# Altium schematic sheet RFID reader circuit.SchDoc
size Letter
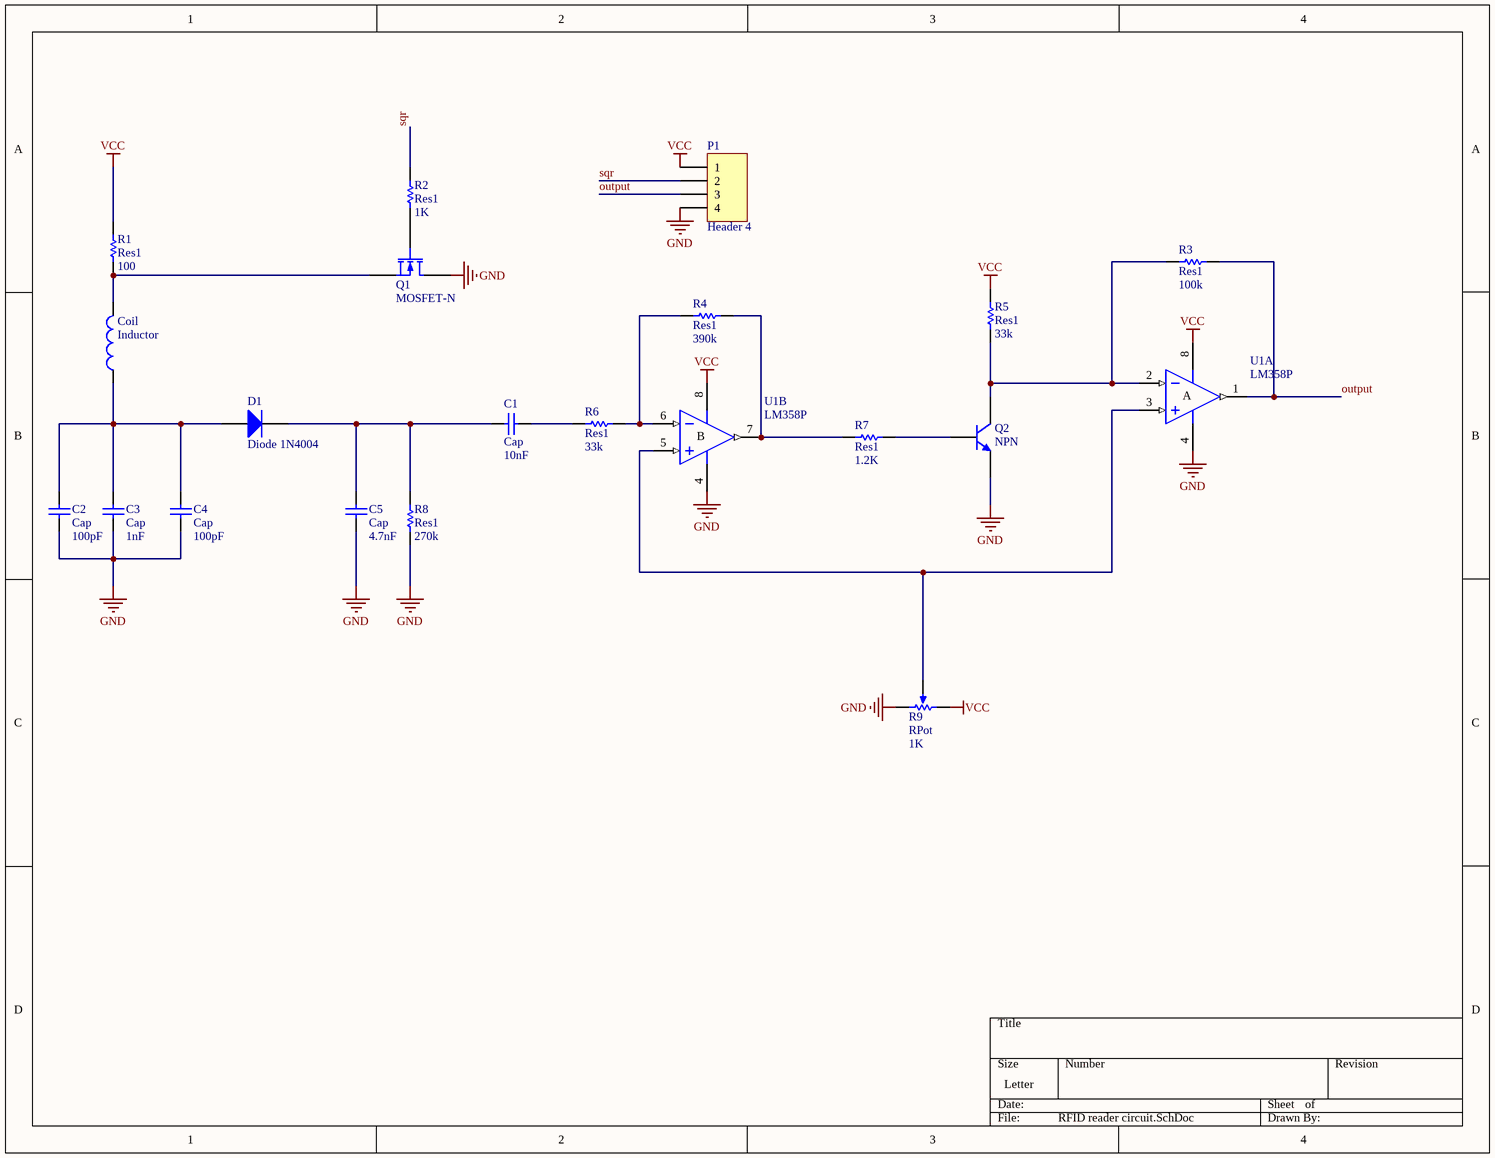
[diagram p0: RFID reader circuit.SchDoc]

## Parts
C1  Cap  value 10nF  [RAD-0.3]
C2  Cap  value 100pF  [RAD-0.3]
C3  Cap  value 1nF  [RAD-0.3]
C4  Cap  value 100pF  [RAD-0.3]
C5  Cap  value 4.7nF  [RAD-0.3]
Coil  Inductor  [XTAL-2]
D1  Diode 1N4004  [DO-41]
P1  Header 4  [HDR1X4]
Q1  MOSFET-N  [E3]
Q2  NPN  [TO-226-AA]
R1  Res1  value 100  [AXIAL-0.3]
R2  Res1  value 1K  [AXIAL-0.3]
R3  Res1  value 100k  [AXIAL-0.3]
R4  Res1  value 390k  [AXIAL-0.3]
R5  Res1  value 33k  [AXIAL-0.3]
R6  Res1  value 33k  [AXIAL-0.3]
R7  Res1  value 1.2K  [AXIAL-0.3]
R8  Res1  value 270k  [AXIAL-0.3]
R9  RPot  value 1K  [VR5]
U1  LM358P  [P008]  (parts A,B of 2)

## Nets
GND: C2.1 C3.1 C4.1 C5.1 P1.4 Q1.1(D) Q2.3(E) R8.2 R9.2(BOT) U1.4(V-)
VCC: P1.1 R1.2 R5.2 R9.1(TOP) U1.8(V+)
output: P1.3 R3.1 U1.1(OUT)
sqr: P1.2 R2.2
NetC1_1: C1.1 R6.1
NetC1_2: C1.2 C5.2 D1.2(K) R8.1
NetC2_2: C2.2 C3.2 C4.2 Coil.1 D1.1(A)
NetCoil_2: Coil.2 Q1.3(S) R1.1
NetQ1_2: Q1.2(G) R2.1
NetQ2_1: Q2.1(C) R3.2 R5.1 U1.2(IN-)
NetQ2_2: Q2.2(B) R7.2
NetR4_1: R4.1 R6.2 U1.6(IN-)
NetR4_2: R4.2 R7.1 U1.7(OUT)
NetR9_3: R9.3(TAP) U1.3(IN+) U1.5(IN+)

## Notes on the sheet
- (in symbol LM358P, part A) A
- (in symbol LM358P, part B) B

## Library data of the parts
C1-C5 = Cap: Capacitor; Published: 8-Jun-2000; LatestRevisionDate: 17-Jul-2002; LatestRevisionNote: Re-released for DXP Platform.; PackageReference: RAD-0.3; Publisher: Altium Limited; PackageDescription: Radial Cap, Thru-Hole; 2 Leads; 0.3 in Pin Spacing
Coil = Inductor: Code_IEC: 1005; Published: 8-Jun-2000; LatestRevisionDate: 29-May-2009; LatestRevisionNote: IPC-7351 Footprint Added.; PackageReference: 0402-A; Publisher: Altium Limited; PackageDescription: Chip Inductor; Code_JEITA: 0402
D1 = Diode 1N4004: 1 Amp General Purpose Rectifier; Published: 8-Jun-2000; LatestRevisionDate: 17-Jul-2002; LatestRevisionNote: Re-released for DXP Platform.; DatasheetVersion: 1998; PackageVersion: Aug-1999; PackageReference: DO-41; Publisher: Altium Limited; PackageDescription: Diode, Axial; Body 5.2 x 2.7 mm (LxDia. max), Lead Dia. 0.86 mm (max); Code_JEDEC: DO-204-AL; ComponentLink1Description: Manufacturer Link; ComponentLink1URL: http://www.fairchildsemi.com/; ComponentLink2Description: Datasheet; ComponentLink2URL: http://www.fairchildsemi.com/ds/1N%2F1N4001.pdf
P1 = Header 4: Header, 4-Pin; LatestRevisionDate: 17-Jul-2002; LatestRevisionNote: Re-released for DXP Platform.; Publisher: Altium Limited
Q1 = MOSFET-N: N-Channel MOSFET; Published: 8-Jun-2000; LatestRevisionDate: 17-Jul-2002; LatestRevisionNote: Re-released for DXP Platform.; PackageVersion: 1995/1996; PackageReference: E3; Publisher: Altium Limited; PackageDescription: TO, Flat Index; 3 In-Line, Axial Leads; Body Dia. 4.6mm; Lead Dia. 0.5 mm (max)
Q2 = NPN: NPN Bipolar Transistor; Published: 8-Jun-2000; LatestRevisionDate: 17-Jul-2002; LatestRevisionNote: Re-released for DXP Platform.; PackageReference: TO-226-AA; Publisher: Altium Limited; PackageDescription: TO, Flat Index; 3 In-Line, Axial Leads; Body Dia. 4.8mm; Leads 0.55 x 0.51 mm (max); Code_JEDEC: TO-226-AA
R1-R8 = Res1: Resistor; Published: 8-Jun-2000; LatestRevisionDate: 17-Jul-2002; LatestRevisionNote: Re-released for DXP Platform.; PackageReference: AXIAL-0.3; Publisher: Altium Limited; PackageDescription: Axial Device, Thru-Hole; 2 Leads; 0.3 in Pin Spacing
R9 = RPot: Potentiometer; Sim Note: Enter the Resistance value and the set point into parameter fields.; Set Position: 0.5; Published: 8-Jun-2000; LatestRevisionDate: 17-Jul-2002; LatestRevisionNote: Re-released for DXP Platform.; PackageReference: VR5; Publisher: Altium Limited; PackageDescription: Variable Resistor, Thru-Hole; 3 Leads
U1 = LM358P: Dual Operational Amplifier; Published: 16-Jan-2001; LatestRevisionDate: 04-Mar-2005; LatestRevisionNote: Stylized 3D Model Added.; DatasheetVersion: Jul-1998; PackageVersion: Jun-1999; PackageReference: P008; Publisher: Altium Limited; PackageDescription: DIP; 8 Leads; Row Spacing 7.62 mm; Pitch 2.54 mm; Code_JEDEC: MO-001-AN; ComponentLink1Description: Manufacturer Link; ComponentLink1URL: http://www.ti.com/; ComponentLink2Description: Datasheet; ComponentLink2URL: http://www-s.ti.com/sc/ds/lm358.pdf